# EAGLE design tqfp100 (EAGLE 6.6.0)
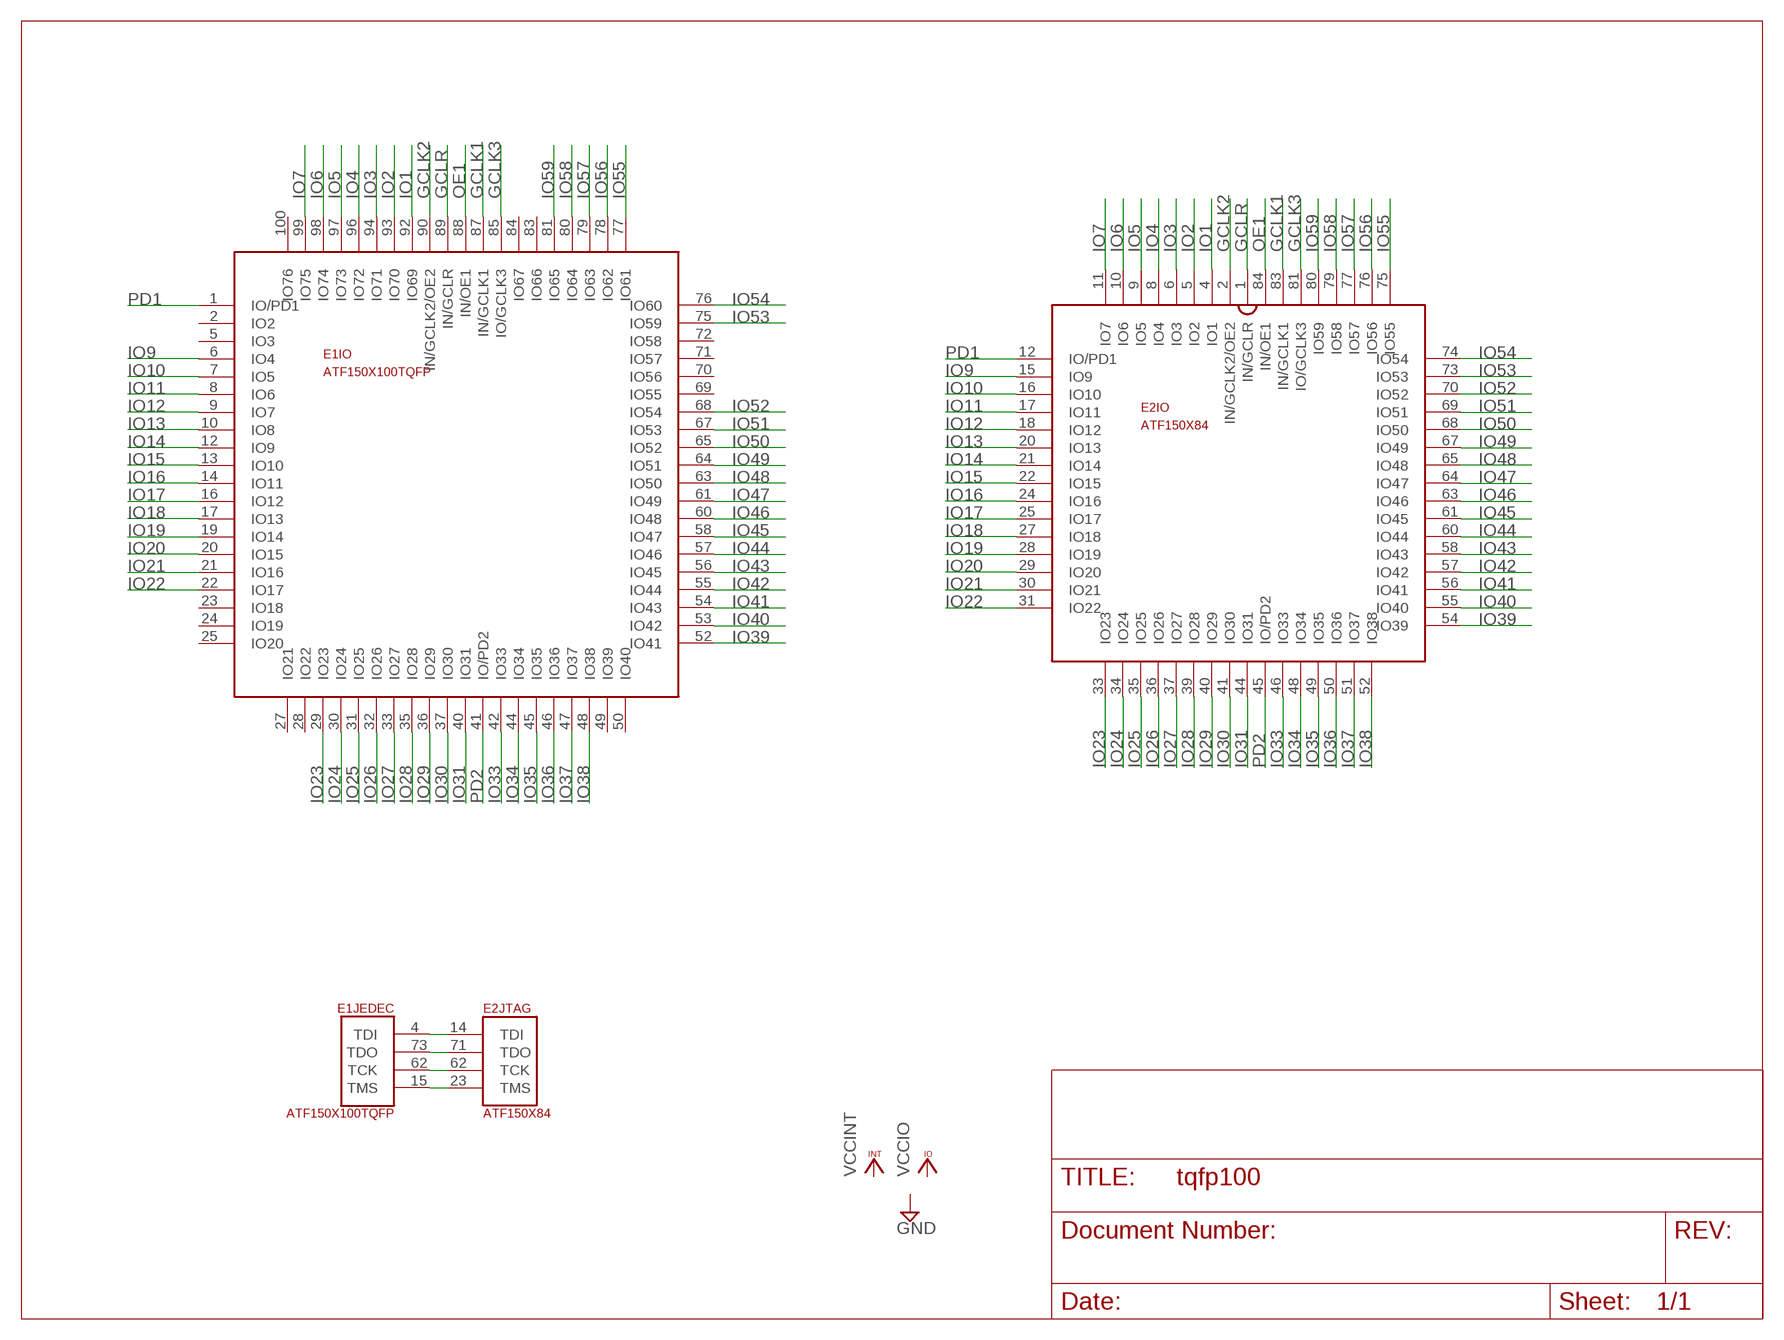
[diagram p0: schematic, sheet 1]

## Parts
E1  ATF150X100TQFP  [TQFP-100]
E2  ATF150X84  [S84]

## Nets
GCLK1: E1.87(IO:IN/GCLK1) E2.83(IO:IN/GCLK1)
GCLK2: E1.90(IO:IN/GCLK2/OE2) E2.2(IO:IN/GCLK2/OE2)
GCLK3: E1.85(IO:IO/GCLK3) E2.81(IO:IO/GCLK3)
GCLR: E1.89(IO:IN/GCLR) E2.1(IO:IN/GCLR)
IO1: E1.92(IO:IO69) E2.4(IO:IO1)
IO2: E1.93(IO:IO70) E2.5(IO:IO2)
IO3: E1.94(IO:IO71) E2.6(IO:IO3)
IO4: E1.96(IO:IO72) E2.8(IO:IO4)
IO5: E1.97(IO:IO73) E2.9(IO:IO5)
IO6: E1.98(IO:IO74) E2.10(IO:IO6)
IO7: E1.99(IO:IO75) E2.11(IO:IO7)
IO9: E1.6(IO:IO4) E2.15(IO:IO9)
IO10: E1.7(IO:IO5) E2.16(IO:IO10)
IO11: E1.8(IO:IO6) E2.17(IO:IO11)
IO12: E1.9(IO:IO7) E2.18(IO:IO12)
IO13: E1.10(IO:IO8) E2.20(IO:IO13)
IO14: E1.12(IO:IO9) E2.21(IO:IO14)
IO15: E1.13(IO:IO10) E2.22(IO:IO15)
IO16: E1.14(IO:IO11) E2.24(IO:IO16)
IO17: E1.16(IO:IO12) E2.25(IO:IO17)
IO18: E1.17(IO:IO13) E2.27(IO:IO18)
IO19: E1.19(IO:IO14) E2.28(IO:IO19)
IO20: E1.20(IO:IO15) E2.29(IO:IO20)
IO21: E1.21(IO:IO16) E2.30(IO:IO21)
IO22: E1.22(IO:IO17) E2.31(IO:IO22)
IO23: E1.29(IO:IO23) E2.33(IO:IO23)
IO24: E1.30(IO:IO24) E2.34(IO:IO24)
IO25: E1.31(IO:IO25) E2.35(IO:IO25)
IO26: E1.32(IO:IO26) E2.36(IO:IO26)
IO27: E1.33(IO:IO27) E2.37(IO:IO27)
IO28: E1.35(IO:IO28) E2.39(IO:IO28)
IO29: E1.36(IO:IO29) E2.40(IO:IO29)
IO30: E1.37(IO:IO30) E2.41(IO:IO30)
IO31: E1.40(IO:IO31) E2.44(IO:IO31)
IO33: E1.42(IO:IO33) E2.46(IO:IO33)
IO34: E1.44(IO:IO34) E2.48(IO:IO34)
IO35: E1.45(IO:IO35) E2.49(IO:IO35)
IO36: E1.46(IO:IO36) E2.50(IO:IO36)
IO37: E1.47(IO:IO37) E2.51(IO:IO37)
IO38: E1.48(IO:IO38) E2.52(IO:IO38)
IO39: E1.52(IO:IO41) E2.54(IO:IO39)
IO40: E1.53(IO:IO42) E2.55(IO:IO40)
IO41: E1.54(IO:IO43) E2.56(IO:IO41)
IO42: E1.55(IO:IO44) E2.57(IO:IO42)
IO43: E1.56(IO:IO45) E2.58(IO:IO43)
IO44: E1.57(IO:IO46) E2.60(IO:IO44)
IO45: E1.58(IO:IO47) E2.61(IO:IO45)
IO46: E1.60(IO:IO48) E2.63(IO:IO46)
IO47: E1.61(IO:IO49) E2.64(IO:IO47)
IO48: E1.63(IO:IO50) E2.65(IO:IO48)
IO49: E1.64(IO:IO51) E2.67(IO:IO49)
IO50: E1.65(IO:IO52) E2.68(IO:IO50)
IO51: E1.67(IO:IO53) E2.69(IO:IO51)
IO52: E1.68(IO:IO54) E2.70(IO:IO52)
IO53: E1.75(IO:IO59) E2.73(IO:IO53)
IO54: E1.76(IO:IO60) E2.74(IO:IO54)
IO55: E1.77(IO:IO61) E2.75(IO:IO55)
IO56: E1.78(IO:IO62) E2.76(IO:IO56)
IO57: E1.79(IO:IO63) E2.77(IO:IO57)
IO58: E1.80(IO:IO64) E2.79(IO:IO58)
IO59: E1.81(IO:IO65) E2.80(IO:IO59)
OE1: E1.88(IO:IN/OE1) E2.84(IO:IN/OE1)
PD1: E1.1(IO:IO/PD1) E2.12(IO:IO/PD1)
PD2: E1.41(IO:IO/PD2) E2.45(IO:IO/PD2)
TCK: E1.62(JEDEC:TCK) E2.62(JTAG:TCK)
TDI: E1.4(JEDEC:TDI) E2.14(JTAG:TDI)
TDO: E1.73(JEDEC:TDO) E2.71(JTAG:TDO)
TMS: E1.15(JEDEC:TMS) E2.23(JTAG:TMS)
Unconnected: E1.2(IO:IO2) E1.5(IO:IO3) E1.23(IO:IO18) E1.24(IO:IO19) E1.25(IO:IO20) E1.27(IO:IO21) E1.28(IO:IO22) E1.49(IO:IO39) E1.50(IO:IO40) E1.69(IO:IO55) E1.70(IO:IO56) E1.71(IO:IO57) E1.72(IO:IO58) E1.83(IO:IO66) E1.84(IO:IO67) E1.100(IO:IO76)

## Power pins joined to a net without a drawn wire
GND: E1.11(GND) E1.26(GND) E1.38(GND) E1.43(GND) E1.59(GND) E1.74(GND) E1.86(GND) E1.95(GND) E2.7(GND) E2.19(GND) E2.32(GND) E2.42(GND) E2.47(GND) E2.59(GND) E2.72(GND) E2.82(GND)
VCCINT: E1.39(VCCINT) E1.91(VCCINT) E2.3(VCCINT) E2.43(VCCINT)
VCCIO: E1.3(VCCIO) E1.18(VCCIO) E1.34(VCCIO) E1.51(VCCIO) E1.66(VCCIO) E1.82(VCCIO) E2.13(VCCIO) E2.26(VCCIO) E2.38(VCCIO) E2.53(VCCIO) E2.66(VCCIO) E2.78(VCCIO)

## Library data of the parts
E1 = atmel-cpld:ATF150X100: ATF150x in 100 pin package.
E2 = atmel-cpld:ATF150X84: ATF150x in 84 pin package.

## Board
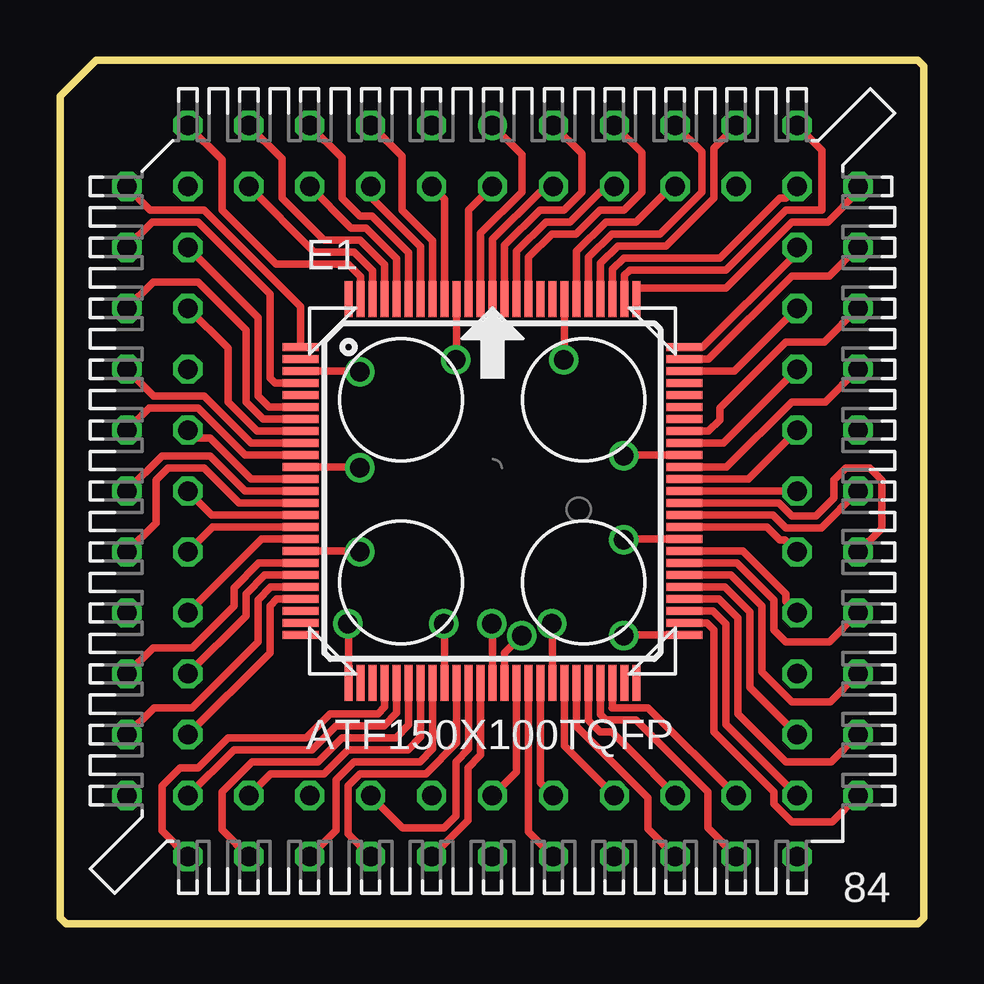
[diagram p1: board, top side]
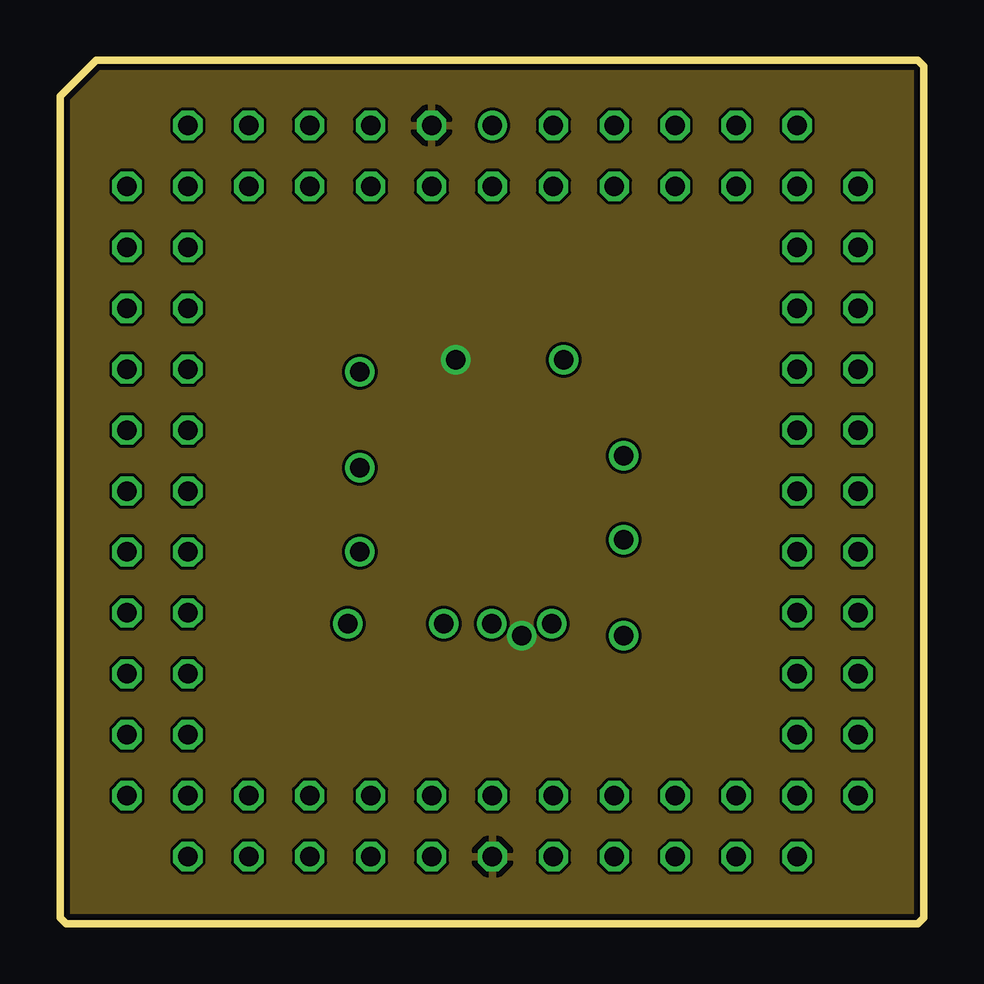
[diagram p2: board, inner layer VCCINT]
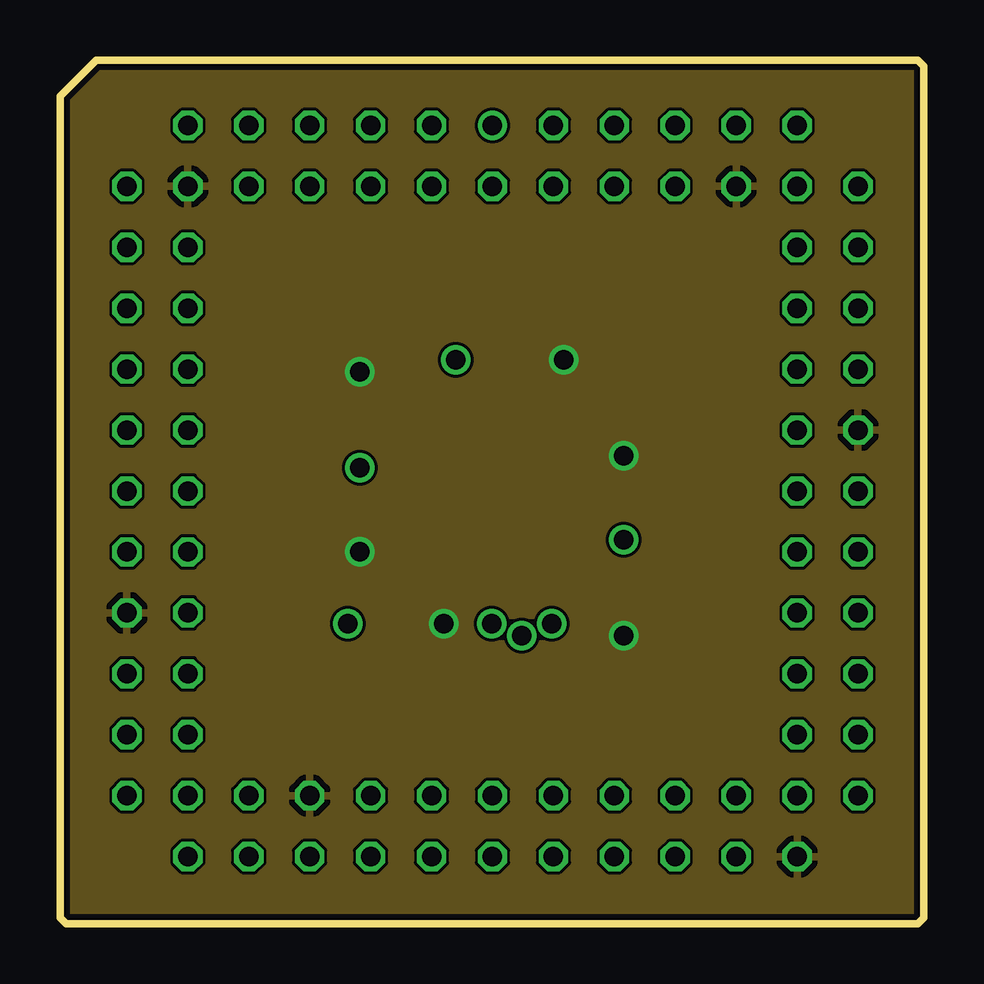
[diagram p3: board, inner layer VCCIO]
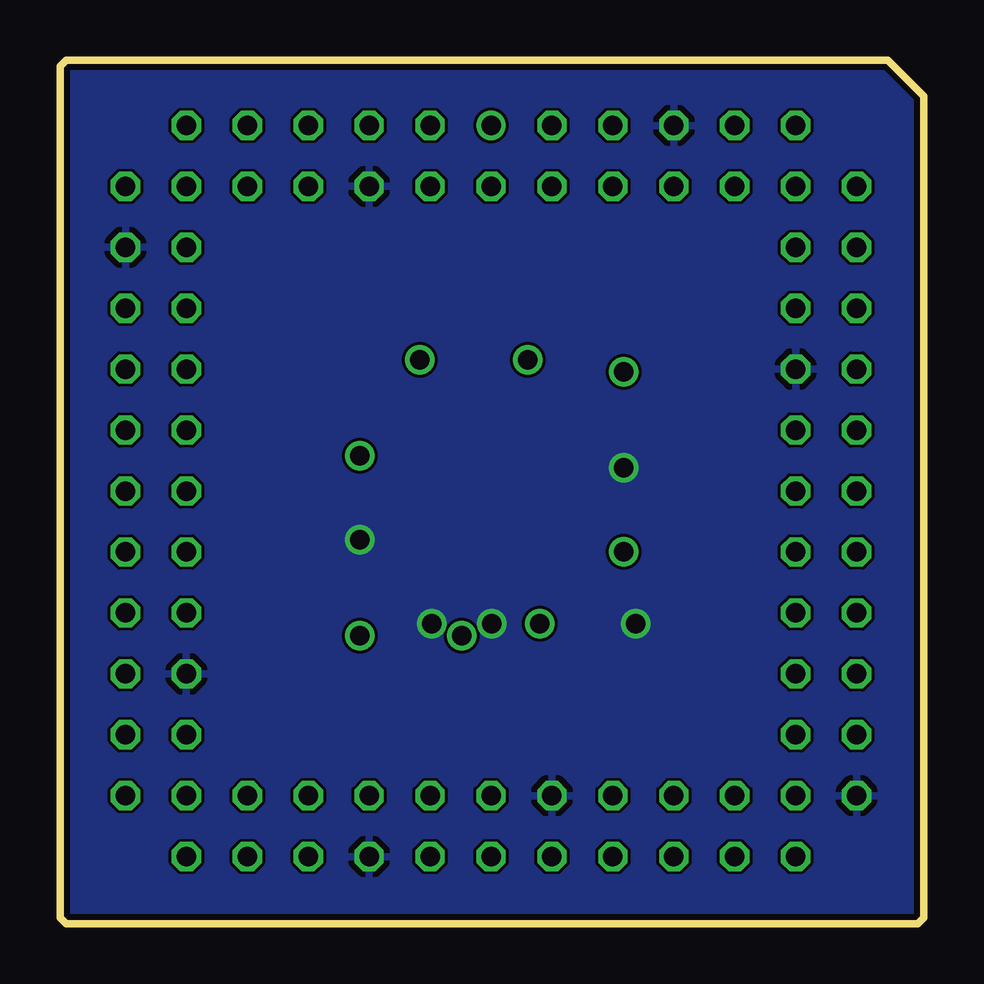
[diagram p4: board, bottom side, seen from below]

Size 36 x 36 mm. Coordinates in mm from the lower left corner, seen from the top.
Outline: 0,0.25 0,34.5 1.5,36 35.75,36 36,35.75 36,0.25 35.75,0 0.25,0 0,0.25
Copper layers (1*2*15*16): Top 0.035mm / dielectric 1.5mm / VCCINT 0.035mm / dielectric 0.15mm / VCCIO 0.035mm / dielectric 0.2mm / GND 0.035mm
Design rules "pld *": minimum track width 12mil, minimum drill 0.25mm, track to track 5mil, track to pad 5mil, pad to pad 5mil, via to via 5mil, smd to smd 5mil, copper to edge 10mil, drill to drill 10mil, minimum pad ring 8mil, minimum via ring 8mil, stop-mask expansion 0mil, vias tented up to drill 0mil, thermal gap 10mil

### Footprints (pad centres in the part's own frame; a part is rotated, then mirrored left to right if it is on the bottom)
TQFP-100 = smd 1.5 x 0.35: 1 -8,6; 2 -8,5.5; 3 -8,5; 4 -8,4.5; 5 -8,4; 6 -8,3.5; 7 -8,3; 8 -8,2.5; 9 -8,2; 10 -8,1.5; 11 -8,1; 12 -8,0.5; 13 -8,0; 14 -8,-0.5; 15 -8,-1; 16 -8,-1.5; 17 -8,-2; 18 -8,-2.5; 19 -8,-3; 20 -8,-3.5; 21 -8,-4; 22 -8,-4.5; 23 -8,-5; 24 -8,-5.5; 25 -8,-6; 51 8,-6; 52 8,-5.5; 53 8,-5; 54 8,-4.5; 55 8,-4; 56 8,-3.5; 57 8,-3; 58 8,-2.5; 59 8,-2; 60 8,-1.5; 61 8,-1; 62 8,-0.5; 63 8,0; 64 8,0.5; 65 8,1; 66 8,1.5; 67 8,2; 68 8,2.5; 69 8,3; 70 8,3.5; 71 8,4; 72 8,4.5; 73 8,5; 74 8,5.5; 75 8,6 | smd 0.35 x 1.5: 26 -6,-8; 27 -5.5,-8; 28 -5,-8; 29 -4.5,-8; 30 -4,-8; 31 -3.5,-8; 32 -3,-8; 33 -2.5,-8; 34 -2,-8; 35 -1.5,-8; 36 -1,-8; 37 -0.5,-8; 38 0,-8; 39 0.5,-8; 40 1,-8; 41 1.5,-8; 42 2,-8; 43 2.5,-8; 44 3,-8; 45 3.5,-8; 46 4,-8; 47 4.5,-8; 48 5,-8; 49 5.5,-8; 50 6,-8; 76 6,8; 77 5.5,8; 78 5,8; 79 4.5,8; 80 4,8; 81 3.5,8; 82 3,8; 83 2.5,8; 84 2,8; 85 1.5,8; 86 1,8; 87 0.5,8; 88 0,8; 89 -0.5,8; 90 -1,8; 91 -1.5,8; 92 -2,8; 93 -2.5,8; 94 -3,8; 95 -3.5,8; 96 -4,8; 97 -4.5,8; 98 -5,8; 99 -5.5,8; 100 -6,8
S84 = drill 0.813: 1 0,15.24 | drill 0.813 octagon: 2 0,12.7; 3 -2.54,15.24; 4 -2.54,12.7; 5 -5.08,15.24; 6 -5.08,12.7; 7 -7.62,15.24; 8 -7.62,12.7; 9 -10.16,15.24; 10 -10.16,12.7; 11 -12.7,15.24; 12 -15.24,12.7; 13 -12.7,12.7; 14 -15.24,10.16; 15 -12.7,10.16; 16 -15.24,7.62; 17 -12.7,7.62; 18 -15.24,5.08; 19 -12.7,5.08; 20 -15.24,2.54; 21 -12.7,2.54; 22 -15.24,0; 23 -12.7,0; 24 -15.24,-2.54; 25 -12.7,-2.54; 26 -15.24,-5.08; 27 -12.7,-5.08; 28 -15.24,-7.62; 29 -12.7,-7.62; 30 -15.24,-10.16; 31 -12.7,-10.16; 32 -15.24,-12.7; 33 -12.7,-15.24; 34 -12.7,-12.7; 35 -10.16,-15.24; 36 -10.16,-12.7; 37 -7.62,-15.24; 38 -7.62,-12.7; 39 -5.08,-15.24; 40 -5.08,-12.7; 41 -2.54,-15.24; 42 -2.54,-12.7; 43 0,-15.24; 44 0,-12.7; 45 2.54,-15.24; 46 2.54,-12.7; 47 5.08,-15.24; 48 5.08,-12.7; 49 7.62,-15.24; 50 7.62,-12.7; 51 10.16,-15.24; 52 10.16,-12.7; 53 12.7,-15.24; 54 15.24,-12.7; 55 12.7,-12.7; 56 15.24,-10.16; 57 12.7,-10.16; 58 15.24,-7.62; 59 12.7,-7.62; 60 15.24,-5.08; 61 12.7,-5.08; 62 15.24,-2.54; 63 12.7,-2.54; 64 15.24,0; 65 12.7,0; 66 15.24,2.54; 67 12.7,2.54; 68 15.24,5.08; 69 12.7,5.08; 70 15.24,7.62; 71 12.7,7.62; 72 15.24,10.16; 73 12.7,10.16; 74 15.24,12.7; 75 12.7,15.24; 76 12.7,12.7; 77 10.16,15.24; 78 10.16,12.7; 79 7.62,15.24; 80 7.62,12.7; 81 5.08,15.24; 82 5.08,12.7; 83 2.54,15.24; 84 2.54,12.7

### Placement (x,y rotation side)
E1  18.03,18.03 0 top
E2  18.03,18.03 0 top

### Tracks (layer width: path | path; a pad name or v marks a point on that pad's centre or on a via)
GCLK1
  Top 0.305: E1.87 18.53,28.28 20,29.75 21,29.75 21.75,30.5 21.75,32.09 E2.83
GCLK2
  Top 0.305: E1.90 17.03,29.73 E2.2
GCLK3
  Top 0.305: E1.85 19.53,27.78 20.5,28.75 21.5,28.75 22.5,29.75 23.5,29.75 24.25,30.5 24.25,32.13 E2.81
GCLR
  Top 0.305: E1.89 17.53,28.78 19.25,30.5 19.25,32.05 E2.1
GND  (via drill 0.81)
  Top 0.305: E1.95 14.53,27.97 13,29.5 12.5,29.5 11.75,30.25 11.75,31.93 E2.7 | E1.86 19.03,28.03 20.25,29.25 21.25,29.25 22.5,30.5 22.88,30.5 E2.82 | E1.74 27.03,23.53 30.5,27 32.08,27 E2.72 | E1.11 12.47,19.03 v12.5,19 | E1.26 12.03,12.47 v12,12.5 | E1.38 18.03,12.47 v18,12.5 | E1.43 20.53,12.47 v20.5,12.5 | E1.59 24.03,16.03 v23.5,16
  pour GND: 0,0 36,0 36,36 0,36
IO1
  Top 0.305: E1.92 16.03,30.19 E2.4
IO2
  Top 0.305: E2.5 12.98,33.27 14.25,32 14.25,29.75 15.53,28.47 E1.93
IO3
  Top 0.305: E1.94 15.03,28.22 13,30.25 13,30.68 E2.6
IO4
  Top 0.305: E1.96 14.03,27.72 12.75,29 12.14,29 E2.8
IO5
  Top 0.305: E1.97 13.53,27.47 12.5,28.5 11,28.5 9.25,30.25 9.25,31.89 E2.9
IO6
  Top 0.305: E1.98 13.03,27.22 12.25,28 10.6,28 E2.10
IO7
  Top 0.305: E1.99 12.53,26.97 12,27.5 9,27.5 6.75,29.75 6.75,31.85 E2.11
IO9
  Top 0.305: E1.6 8.72,21.53 8.25,22 8.25,25.27 E2.15
IO10
  Top 0.305: E1.7 8.47,21.03 7.75,21.75 7.75,24.75 5.75,26.75 3.89,26.75 E2.16
IO11
  Top 0.305: E1.8 8.22,20.53 7,21.75 7,23.98 E2.17
IO12
  Top 0.305: E1.9 7.97,20.03 6,22 3.9,22 E2.18
IO13
  Top 0.305: E1.10 7.72,19.53 5.75,21.5 3.72,21.5 E2.20
IO14
  Top 0.305: E1.12 7.97,18.53 6.25,20.25 5.65,20.25 E2.21
IO15
  Top 0.305: E1.13 7.72,18.03 6.25,19.5 4.26,19.5 E2.22
IO16
  Top 0.305: E1.14 7.47,17.53 6,19 4.5,19 4,18.5 4,16.7 E2.24
IO17
  Top 0.305: E1.16 6.37,16.53 E2.25
IO18
  Top 0.305: E1.17 8.41,16.03 E2.27
IO19
  Top 0.305: E1.19 8.28,15.03 7.25,14 7.25,13.25 5.5,11.5 3.88,11.5 E2.28
IO20
  Top 0.305: E1.20 8.53,14.53 7.75,13.75 7.75,12.83 E2.29
IO21
  Top 0.305: E1.21 8.78,14.03 8.25,13.5 8.25,11.75 5.5,9 3.92,9 E2.30
IO22
  Top 0.305: E1.22 9.03,13.53 8.75,13.25 8.75,11.29 E2.31
IO23
  Top 0.305: E1.29 13.53,9.03 13.25,8.75 11.25,8.75 10.25,7.75 7,7.75 5.75,6.5 5,6.5 4.25,5.75 4.25,3.87 E2.33
IO24
  Top 0.305: E1.30 14.03,8.78 13.5,8.25 11.5,8.25 10.5,7.25 7.25,7.25 E2.34
IO25
  Top 0.305: E1.31 14.53,8.28 14,7.75 11.75,7.75 10.75,6.75 8,6.75 6.75,5.5 6.75,3.91 E2.35
IO26
  Top 0.305: E1.32 15.03,7.78 14.5,7.25 12,7.25 11,6.25 8.79,6.25 E2.36
IO27
  Top 0.305: E1.33 15.53,7.28 15,6.75 12.25,6.75 11.5,6 11.5,3.88 E2.37
IO28
  Top 0.305: E1.35 16.53,7.53 15.25,6.25 12.5,6.25 12,5.75 12,3.74 E2.39
IO29
  Top 0.305: E1.36 17.03,7.28 16.5,6.75 16.5,4.5 16,4 14.28,4 E2.40
IO30
  Top 0.305: E1.37 17.53,7.03 17,6.5 17,4.3 E2.41
IO31
  Top 0.305: E1.40 19.03,6.33 E2.44
IO33
  Top 0.305: E1.42 20.03,5.87 E2.46
IO34
  Top 0.305: E1.44 21.03,7.41 E2.48
IO35
  Top 0.305: E1.45 21.53,8.22 24.5,5.25 24.5,3.94 E2.49
IO36
  Top 0.305: E1.46 22.03,8.47 22.5,8 23,8 23.75,7.23 E2.50
IO37
  Top 0.305: E1.47 22.53,8.72 22.75,8.5 24,8.5 27,5.5 27,3.98 E2.51
IO38
  Top 0.305: E1.48 23.03,9.03 23,9 24.52,9 E2.52
IO39
  Top 0.305: E1.52 26.97,12.53 27.25,12.25 27.25,8 29.75,5.5 29.75,5 30.5,4.25 32.19,4.25 E2.54
IO40
  Top 0.305: E1.53 27.22,13.03 27.75,12.5 27.75,8.31 E2.55
IO41
  Top 0.305: E1.54 27.47,13.53 28.25,12.75 28.25,8.75 30.25,6.75 32.15,6.75 E2.56
IO42
  Top 0.305: E1.55 27.72,14.03 28.75,13 28.75,9.85 E2.57
IO43
  Top 0.305: E1.56 27.97,14.53 29.25,13.25 29.25,10.5 30.5,9.25 32.11,9.25 E2.58
IO44
  Top 0.305: E1.57 28.22,15.03 29.75,13.5 29.75,12.25 30.25,11.75 32.07,11.75 E2.60
IO45
  Top 0.305: E1.58 28.47,15.53 30.25,13.75 30.25,13.43 E2.61
IO46
  Top 0.305: E1.60 29.47,16.53 30,16 30.22,16 E2.63
IO47
  Top 0.305: E1.61 29.72,17.03 30.25,16.5 31.74,16.5 E2.64
IO48
  Top 0.305: E1.63 E2.65
IO49
  Top 0.305: E1.64 28.69,18.53 E2.67
IO50
  Top 0.305: E2.68 31.91,21.75 30.5,21.75 27.78,19.03 E1.65
IO51
  Top 0.305: E2.69 27.65,20.03 E1.67
IO52
  Top 0.305: E2.70 31.87,24.25 30.25,24.25 27.5,21.5 27.5,21 27.03,20.53 E1.68
IO53
  Top 0.305: E1.75 26.78,24.03 30.5,27.75 30.5,27.96 E2.73
IO54
  Top 0.305: E1.76 24.03,26.5 27.75,26.5 30.5,29.25 32,29.25 33.27,30.52 E2.74
IO55
  Top 0.305: E2.75 31.75,32.25 31.75,29.75 30.25,29.75 27.75,27.25 23.75,27.25 23.53,27.03 E1.77
IO56
  Top 0.305: E1.78 23.03,27.28 23.5,27.75 27.5,27.75 30,30.25 30.25,30.25 E2.76
IO57
  Top 0.305: E1.79 22.53,27.53 23.25,28.25 25.25,28.25 27.25,30.25 27.25,32.33 E2.77
IO58
  Top 0.305: E2.79 26.75,32.17 26.75,30.5 25,28.75 23,28.75 22.03,27.78 E1.80
IO59
  Top 0.305: E1.81 21.53,28.03 22.75,29.25 24,29.25 25.5,30.75 25.63,30.75 E2.80
OE1
  Top 0.305: E1.88 18.03,28.53 20,30.5 20.34,30.5 E2.84
PD1
  Top 0.305: E1.1 10.03,25.72 6,29.75 3.77,29.75 E2.12
PD2
  Top 0.305: E1.41 19.53,3.83 E2.45
TCK
  Top 0.305: E1.62 29.97,17.53 30.5,17 31.5,17 32.25,17.75 32.25,18.5 32.75,19 33.75,19 34.25,18.5 34.25,16.47 E2.62
TDI
  Top 0.305: E1.4 8.97,22.53 8.75,22.75 8.75,26.25 5.75,29.25 3.85,29.25 E2.14
TDO
  Top 0.305: E1.73 28.11,23.03 E2.71
TMS
  Top 0.305: E1.15 6.33,17.03 E2.23
VCCINT  (via drill 0.81)
  Top 0.305: E1.91 16.53,23.53 v16.5,23.5 | E1.39 18.53,11.28 v19.25,12
  pour VCCINT: 0,0 36,0 36,36 0,36
VCCIO  (via drill 0.81)
  Top 0.305: E1.82 21.03,23.53 v21,23.5 | E1.66 23.53,19.53 v23.5,19.5 | E1.51 24.03,12.03 v23.5,12 | E1.3 12.47,23.03 v12.5,23 | E1.18 12.47,15.53 v12.5,15.5 | E1.34 16.03,12.47 v16,12.5
  pour VCCIO: 0,0 36,0 36,36 0,36